# Altium schematic sheet 03_mcu_switches.SchDoc
size A; SheetNumber: 13; SheetTotal: 17
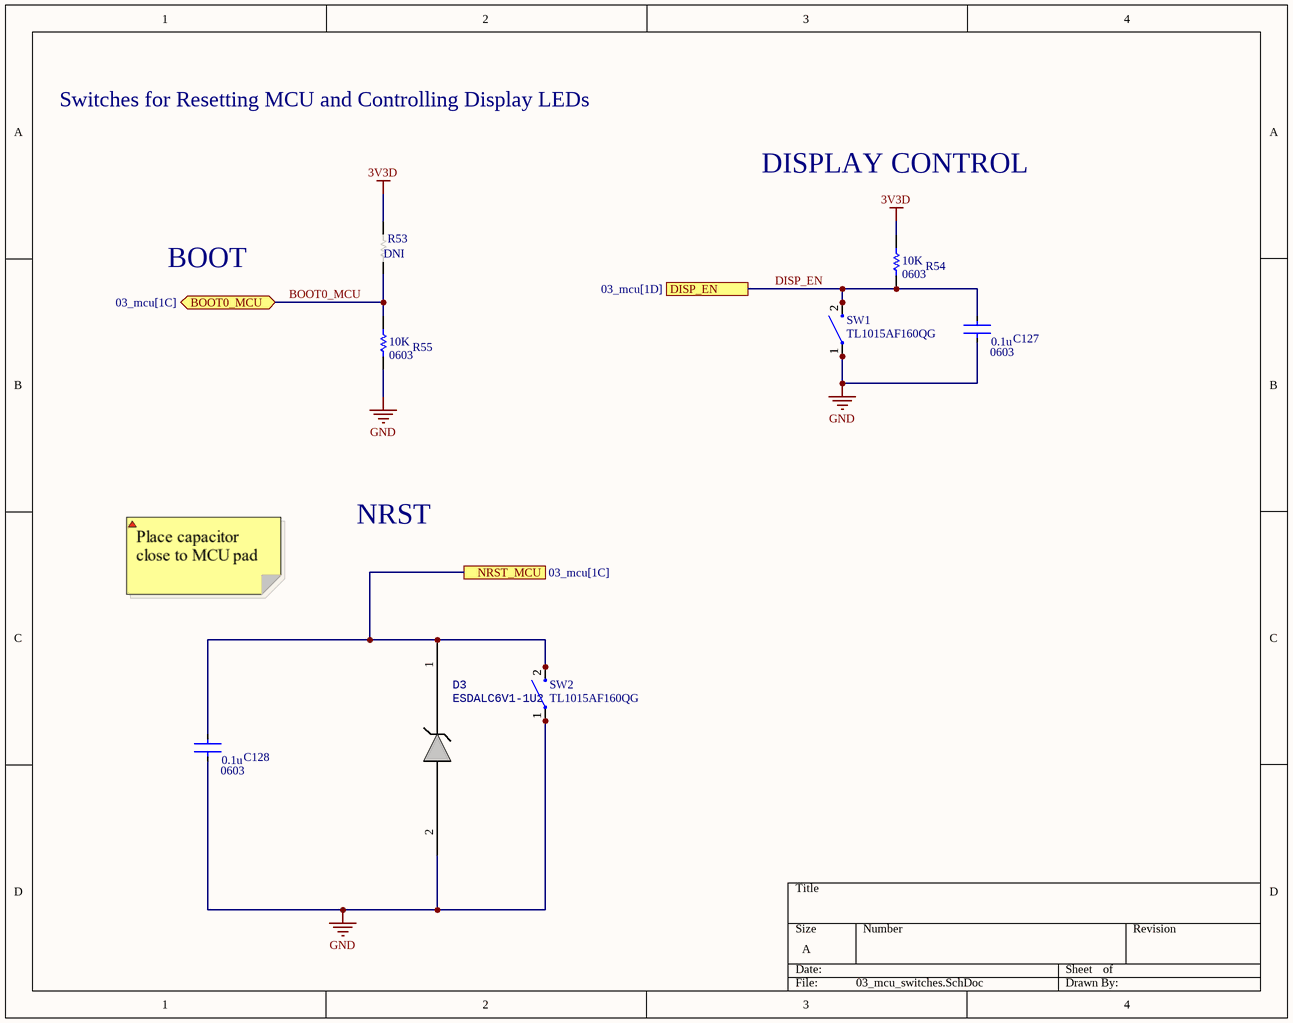
[diagram p0: 03_mcu_switches.SchDoc]

## Parts
C127  CGA3E2X7R1H104K080AA  [CAPTDK0603]  (value not drawn)
C128  CGA3E2X7R1H104K080AA  [CAPTDK0603]  (value not drawn)
D3  ESDALC6V1-1U2  [DIODE_ESDALC6V1-1U2_STM]
R53  DNI  [RES_0603]
R54  RMCF0603JG10K0  [RES-STACK-POLE-0603]  (value not drawn)
R55  RMCF0603JG10K0  [RES-STACK-POLE-0603]  (value not drawn)
SW1  TL1015AF160QG  [TACTILE-SWITCH]
SW2  TL1015AF160QG  [TACTILE-SWITCH]

## Ports
BOOT0_MCU (bidir, see 03_mcu[1C]), DISP_EN (see 03_mcu[1D]), NRST_MCU (see 03_mcu[1C])

## Nets
3V3D: R53.2 R54.2
GND: C127.2 C128.2 D3.2 R55.1 SW1.1 SW2.1
BOOT0_MCU: R53.1 R55.2 ; port BOOT0_MCU
DISP_EN: C127.1 R54.1 SW1.2 ; port DISP_EN
NRST_MCU: C128.1 D3.1 SW2.2 ; port NRST_MCU

## Notes on the sheet
- Switches for Resetting MCU and Controlling Display LEDs
- DISPLAY CONTROL
- BOOT
- NRST
- (in symbol CGA3E2X7R1H104K080AA) 0.1u; 0603
- (in symbol RMCF0603JG10K0) 10K; 0603

## Library data of the parts
C127 C128 = CGA3E2X7R1H104K080AA: CAP CER 0.1UF 50V X7R 0603; Supplier 1: Digi-Key; Supplier Part Number 1: 445-5666-1-ND
D3 = ESDALC6V1: TVS DIODE 3VWM ST0201; Supplier 1: Digikey; Supplier Part Number 1: 497-8752-1-ND
R53 = R0603: RES DNI 0603
R54 R55 = RMCF0603JG10K0: RES 10K OHM 5% 1/10W 0603; Supplier 1: Digi-Key; Supplier Part Number 1: 738-RMCF0603JG10K0CT-ND
SW1 SW2 = TL1015AF160QG: SWITCH TACTILE SPST-NO 0.05A 12V; Supplier 1: Digi-Key; Supplier Part Number 1: EG4344CT-ND